# Altium schematic sheet 02-100BASETX_PHY.SchDoc
size A3; SheetNumber: 2; SheetTotal: 2
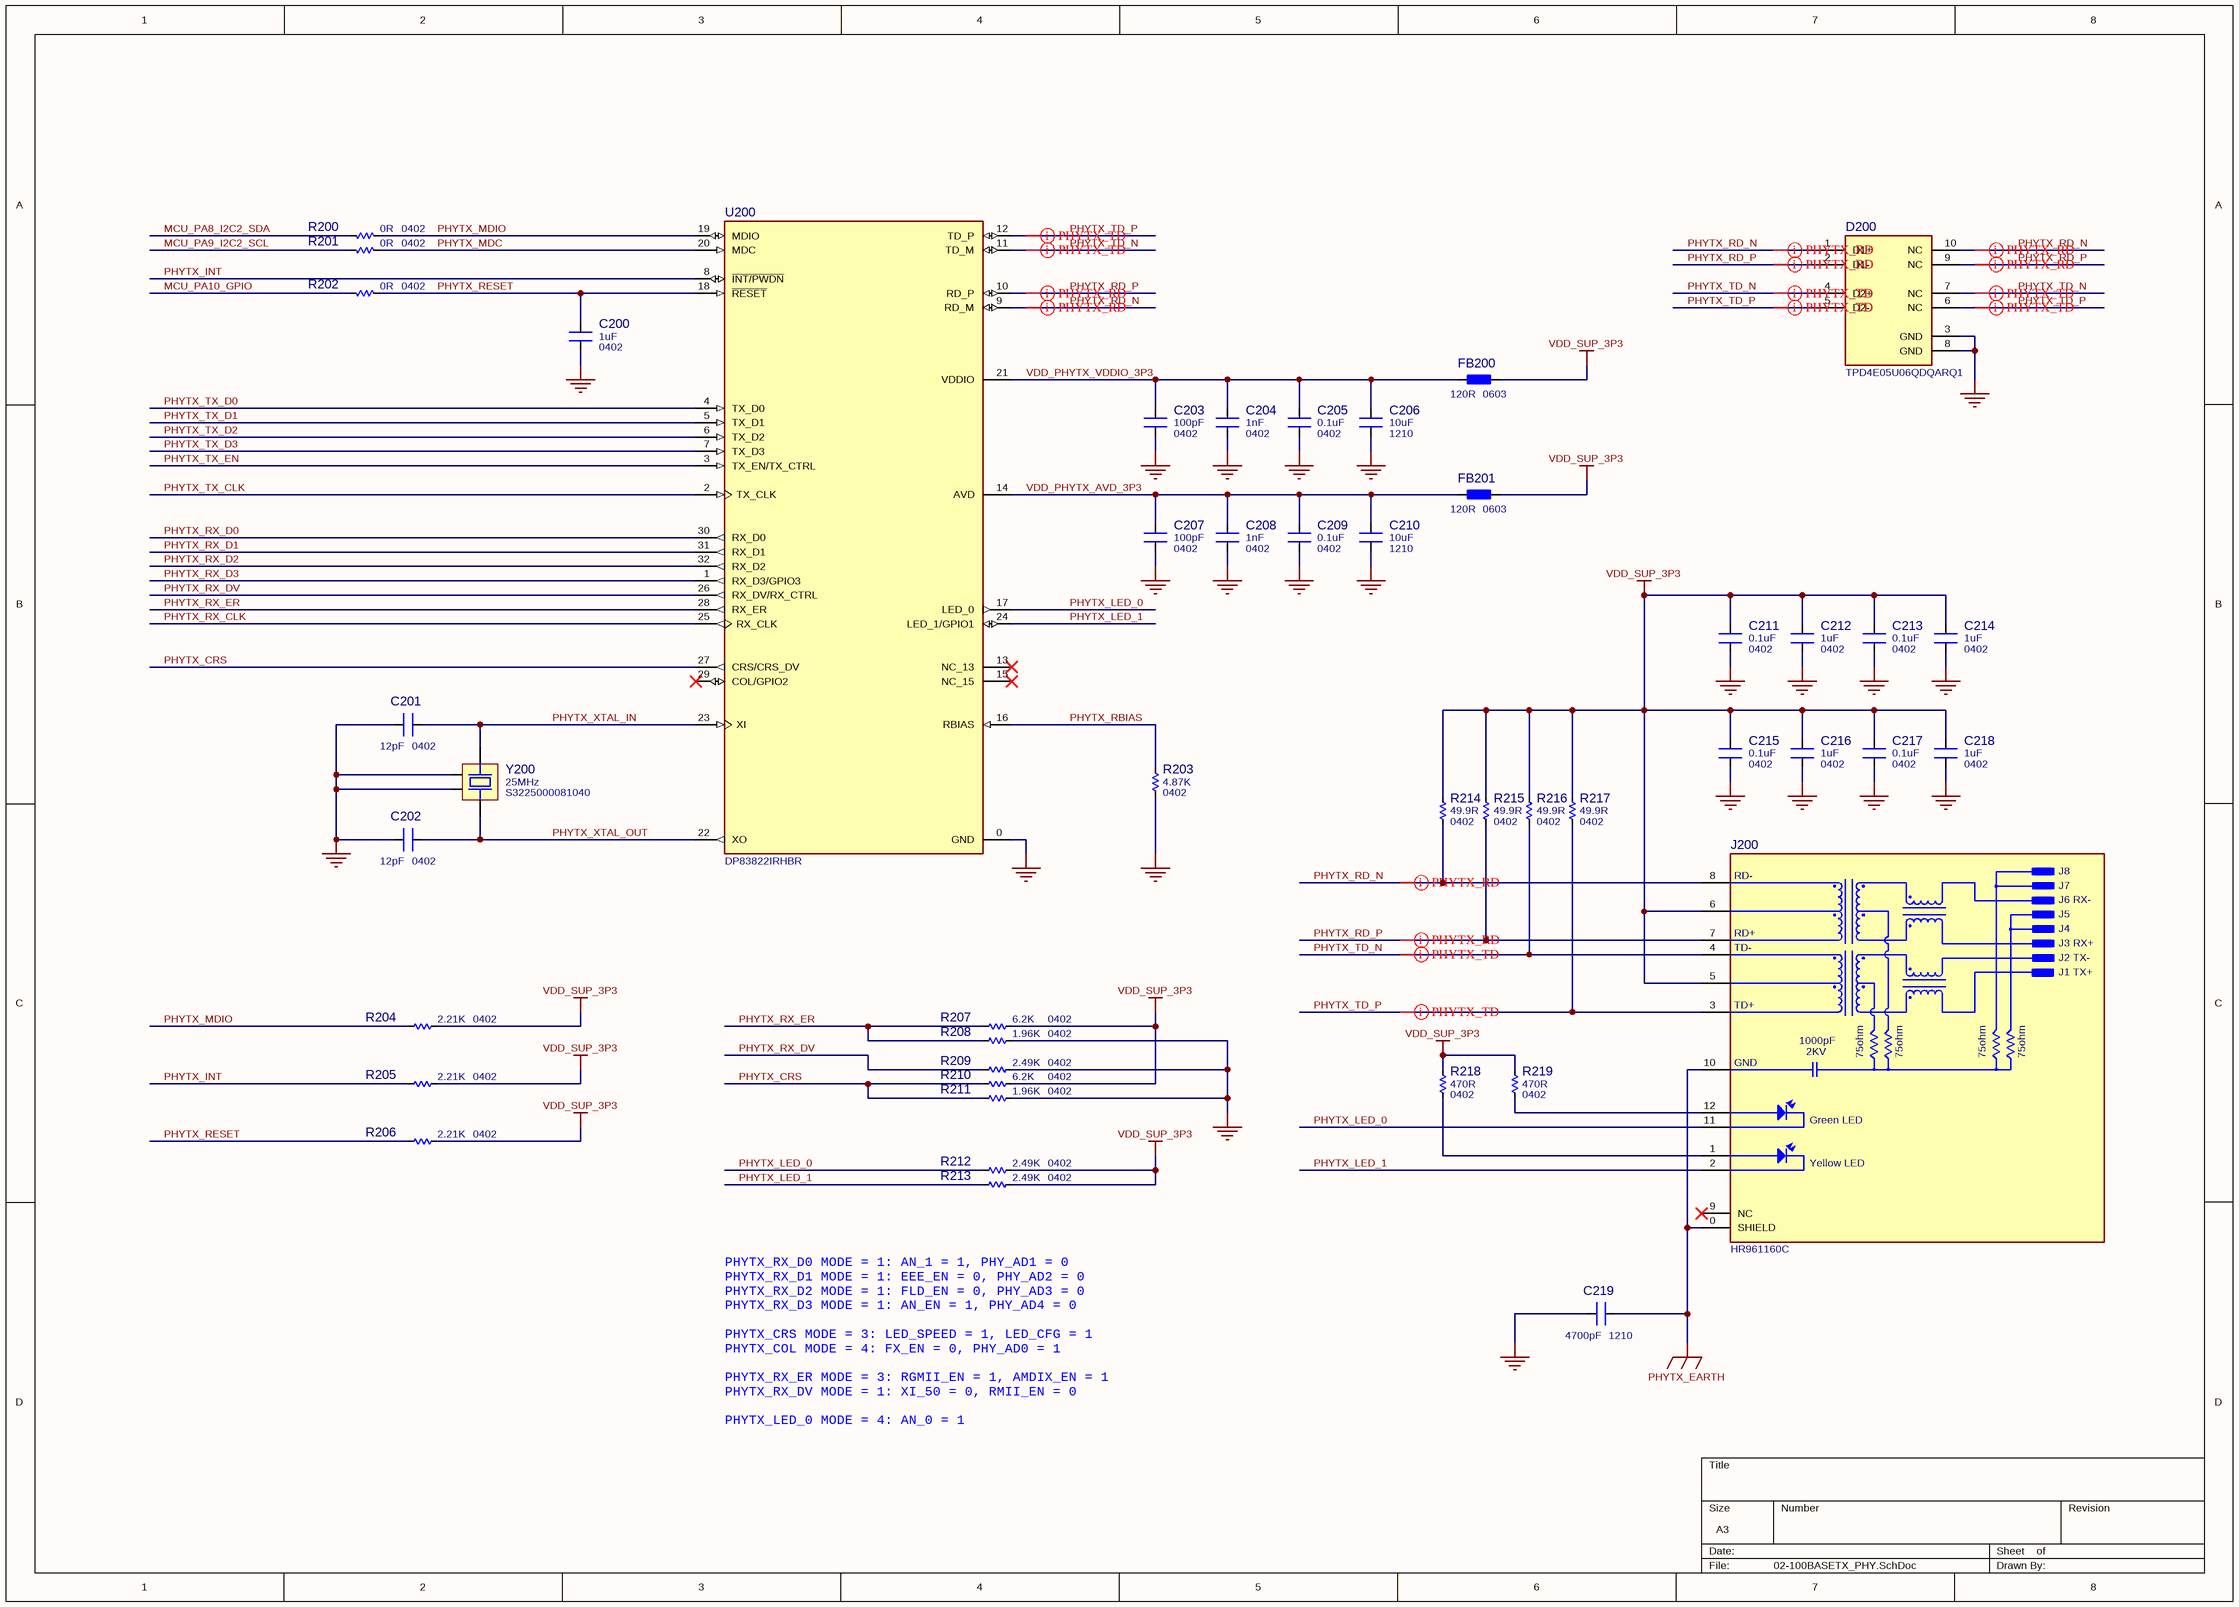
[diagram p0: 02-100BASETX_PHY.SchDoc]

## Parts
C200  value 1uF  Package: 0402  [CAP_C_0402]  (hidden comment: Capacitor NP)
C201  value 12pF  Package: 0402  [CAP_C_0402]  (hidden comment: Capacitor NP)
C202  value 12pF  Package: 0402  [CAP_C_0402]  (hidden comment: Capacitor NP)
C203  value 100pF  Package: 0402  [CAP_C_0402]  (hidden comment: Capacitor NP)
C204  value 1nF  Package: 0402  [CAP_C_0402]  (hidden comment: Capacitor NP)
C205  value 0.1uF  Package: 0402  [CAP_C_0402]  (hidden comment: Capacitor NP)
C206  value 10uF  Package: 1210  [CAP_C_1210]  (hidden comment: Capacitor NP)
C207  value 100pF  Package: 0402  [CAP_C_0402]  (hidden comment: Capacitor NP)
C208  value 1nF  Package: 0402  [CAP_C_0402]  (hidden comment: Capacitor NP)
C209  value 0.1uF  Package: 0402  [CAP_C_0402]  (hidden comment: Capacitor NP)
C210  value 10uF  Package: 1210  [CAP_C_1210]  (hidden comment: Capacitor NP)
C211  value 0.1uF  Package: 0402  [CAP_C_0402]  (hidden comment: Capacitor NP)
C212  value 1uF  Package: 0402  [CAP_C_0402]  (hidden comment: Capacitor NP)
C213  value 0.1uF  Package: 0402  [CAP_C_0402]  (hidden comment: Capacitor NP)
C214  value 1uF  Package: 0402  [CAP_C_0402]  (hidden comment: Capacitor NP)
C215  value 0.1uF  Package: 0402  [CAP_C_0402]  (hidden comment: Capacitor NP)
C216  value 1uF  Package: 0402  [CAP_C_0402]  (hidden comment: Capacitor NP)
C217  value 0.1uF  Package: 0402  [CAP_C_0402]  (hidden comment: Capacitor NP)
C218  value 1uF  Package: 0402  [CAP_C_0402]  (hidden comment: Capacitor NP)
C219  value 4700pF  Package: 1210  [CAP_C_1210]  (hidden comment: Capacitor NP)
D200  Manufacturer Part Number: TPD4E05U06QDQARQ1  [SON50P100X250X55-10N]  (hidden comment: TPDxE05U06-Q1)
FB200  value 120R  Package: 0603  [IND_C_0603]  (hidden comment: Ferrite bead)
FB201  value 120R  Package: 0603  [IND_C_0603]  (hidden comment: Ferrite bead)
J200  HR961160C  [RJ-45_HR961160C]
R200  value 0R  Package: 0402  [RES_C_0402]  (hidden comment: Resistor)
R201  value 0R  Package: 0402  [RES_C_0402]  (hidden comment: Resistor)
R202  value 0R  Package: 0402  [RES_C_0402]  (hidden comment: Resistor)
R203  value 4.87K  Package: 0402  [RES_C_0402]  (hidden comment: Resistor)
R204  value 2.21K  Package: 0402  [RES_C_0402]  (hidden comment: Resistor)
R205  value 2.21K  Package: 0402  [RES_C_0402]  (hidden comment: Resistor)
R206  value 2.21K  Package: 0402  [RES_C_0402]  (hidden comment: Resistor)
R207  value 6.2K  Package: 0402  [RES_C_0402]  (hidden comment: Resistor)
R208  value 1.96K  Package: 0402  [RES_C_0402]  (hidden comment: Resistor)
R209  value 2.49K  Package: 0402  [RES_C_0402]  (hidden comment: Resistor)
R210  value 6.2K  Package: 0402  [RES_C_0402]  (hidden comment: Resistor)
R211  value 1.96K  Package: 0402  [RES_C_0402]  (hidden comment: Resistor)
R212  value 2.49K  Package: 0402  [RES_C_0402]  (hidden comment: Resistor)
R213  value 2.49K  Package: 0402  [RES_C_0402]  (hidden comment: Resistor)
R214  value 49.9R  Package: 0402  [RES_C_0402]  (hidden comment: Resistor)
R215  value 49.9R  Package: 0402  [RES_C_0402]  (hidden comment: Resistor)
R216  value 49.9R  Package: 0402  [RES_C_0402]  (hidden comment: Resistor)
R217  value 49.9R  Package: 0402  [RES_C_0402]  (hidden comment: Resistor)
R218  value 470R  Package: 0402  [RES_C_0402]  (hidden comment: Resistor)
R219  value 470R  Package: 0402  [RES_C_0402]  (hidden comment: Resistor)
U200  Manufacturer Part Number: DP83822IRHBR  [QFN50P500X500X100_HS-33N]  (hidden comment: DP83822)
Y200  Manufacturer Part Number: S3225000081040  Frequency: 25MHz  [XT-SMD-3225-4P]  (hidden comment: Crystal)

## Nets
GND: C200.1 C201.2 C202.2 C203.1 C204.1 C205.1 C206.1 C207.1 C208.1 C209.1 C210.1 C211.1 C212.1 C213.1 C214.1 C215.1 C216.1 C217.1 C218.1 C219.2 D200.3(GND) D200.8(GND) R203.2 R208.2 R209.2 R211.2 U200.0(GND) Y200.2 Y200.4
PHYTX_EARTH: C219.1 J200.0(SHIELD) J200.10(GND)
VDD_SUP_3P3: C211.2 C212.2 C213.2 C214.2 C215.2 C216.2 C217.2 C218.2 FB200.1 FB201.1 J200.5(P5) J200.6(P6) R204.2 R205.2 R206.2 R207.2 R210.2 R212.2 R213.2 R214.1 R215.1 R216.1 R217.1 R218.1 R219.1
MCU_PA8_I2C2_SDA: R200.2
MCU_PA9_I2C2_SCL: R201.2
MCU_PA10_GPIO: R202.2
PHYTX_CRS: R210.1 R211.1 U200.27(CRS/CRS_DV)
PHYTX_INT: R205.1 U200.8(~{INT/PWDN})
PHYTX_LED_0: J200.11(GC) R212.1 U200.17(LED_0)
PHYTX_LED_1: J200.2(YC) R213.1 U200.24(LED_1/GPIO1)
PHYTX_MDC: R201.1 U200.20(MDC)
PHYTX_MDIO: R200.1 R204.1 U200.19(MDIO)
PHYTX_RBIAS: R203.1 U200.16(RBIAS)
PHYTX_RD_N: D200.1(D1+) D200.10(NC) J200.8(RD-) R214.2 U200.9(RD_M)
PHYTX_RD_P: D200.2(D1-) D200.9(NC) J200.7(RD+) R215.2 U200.10(RD_P)
PHYTX_RESET: C200.2 R202.1 R206.1 U200.18(~{RESET})
PHYTX_RX_CLK: U200.25(RX_CLK)
PHYTX_RX_D0: U200.30(RX_D0)
PHYTX_RX_D1: U200.31(RX_D1)
PHYTX_RX_D2: U200.32(RX_D2)
PHYTX_RX_D3: U200.1(RX_D3/GPIO3)
PHYTX_RX_DV: R209.1 U200.26(RX_DV/RX_CTRL)
PHYTX_RX_ER: R207.1 R208.1 U200.28(RX_ER)
PHYTX_TD_N: D200.4(D2+) D200.7(NC) J200.4(TD-) R216.2 U200.11(TD_M)
PHYTX_TD_P: D200.5(D2-) D200.6(NC) J200.3(TD+) R217.2 U200.12(TD_P)
PHYTX_TX_CLK: U200.2(TX_CLK)
PHYTX_TX_D0: U200.4(TX_D0)
PHYTX_TX_D1: U200.5(TX_D1)
PHYTX_TX_D2: U200.6(TX_D2)
PHYTX_TX_D3: U200.7(TX_D3)
PHYTX_TX_EN: U200.3(TX_EN/TX_CTRL)
PHYTX_XTAL_IN: C201.1 U200.23(XI) Y200.1
PHYTX_XTAL_OUT: C202.1 U200.22(XO) Y200.3
VDD_PHYTX_AVD_3P3: C207.2 C208.2 C209.2 C210.2 FB201.2 U200.14(AVD)
VDD_PHYTX_VDDIO_3P3: C203.2 C204.2 C205.2 C206.2 FB200.2 U200.21(VDDIO)
NetJ200_1: J200.1(YA) R218.2
NetJ200_12: J200.12(GA) R219.2

Not connected (* = marked no-connect by the designer): J200 9(NC)*; U200 13(NC_13)* 15(NC_15)* 29(COL/GPIO2)*

## Layout directives
differential pair; net class NC_DIFFPAIR_100R_ETH; differential pair class DIFFPAIR_100R_ETH: PHYTX_RD_N, PHYTX_RD_P, PHYTX_TD_N, PHYTX_TD_P

## Notes on the sheet
- PHYTX_RX_D0 MODE = 1: AN_1 = 1, PHY_AD1 = 0
- PHYTX_RX_D1 MODE = 1: EEE_EN = 0, PHY_AD2 = 0
- PHYTX_RX_D2 MODE = 1: FLD_EN = 0, PHY_AD3 = 0
- PHYTX_RX_D3 MODE = 1: AN_EN = 1, PHY_AD4 = 0
- PHYTX_CRS MODE = 3: LED_SPEED = 1, LED_CFG = 1
- PHYTX_COL MODE = 4: FX_EN = 0, PHY_AD0 = 1
- PHYTX_RX_ER MODE = 3: RGMII_EN = 1, AMDIX_EN = 1
- PHYTX_RX_DV MODE = 1: XI_50 = 0, RMII_EN = 0
- PHYTX_LED_0 MODE = 4: AN_0 = 1
- (in symbol HR961160C) J8; J7; J6 RX-; J5; J4; J3 RX+; J2 TX-; J1 TX+; 1000pF; 2KV; 75ohm; Green LED; Yellow LED

## Library data of the parts
C200 C212 C214 C216 C218 = Cap: Ceramic Capacitor SMD 0402 1uF ±10% 25V; Manufacturer: Samsung; Manufacturer Part Number: CL05A105KA5NQNC; Temperature Coeffcient: -55 to 85℃; Revision: 0; Tolerance: ±10%; ComponentLink1URL: http://product.samsungsem.com/mlcc/CL05A105KA5NQN.do; ComponentLink1Description: SVN Datasheet; ComponentLink2URL: *; ComponentLink2Description: Local Datasheet; ComponentLink3URL: D:\Altium\Library\AS50 library\AS50.SchLib; ComponentLink3Description: Open Symbol; ComponentLink4URL: D:\Altium\Library\AS50 library\Capacitors.PcbLib; ComponentLink4Description: Open Footprint; ComponentLink5Description: Open Footprint 2; ComponentLink6Description: Open Footprint 3; ComponentLink7Description: Open Footprint 4; Category: Capacitor; Voltage: 25V; Supplier 1: LCSC; Supplier Part Number 1: C52923
C201 C202 = Cap: Ceramic Capacitor SMD 0402 12pF ±5% 50V; Manufacturer: FH(Guangdong Fenghua Advanced Tech); Manufacturer Part Number: 0402CG120J500NT; Temperature Coeffcient: -55 to 85℃; Revision: 0; Tolerance: ±5%; ComponentLink1URL: https://datasheet.lcsc.com/lcsc/1810111610_FH-Guangdong-Fenghua-Advanced-Tech-0402CG150J500NT_C1548.pdf; ComponentLink1Description: SVN Datasheet; ComponentLink2URL: *; ComponentLink2Description: Local Datasheet; ComponentLink3URL: D:\Altium\Library\AS50 library\AS50.SchLib; ComponentLink3Description: Open Symbol; ComponentLink4URL: D:\Altium\Library\AS50 library\Capacitors.PcbLib; ComponentLink4Description: Open Footprint; ComponentLink5Description: Open Footprint 2; ComponentLink6Description: Open Footprint 3; ComponentLink7Description: Open Footprint 4; Category: Capacitor; Voltage: 50V; Supplier 1: LCSC; Supplier Part Number 1: C1547
C203 C207 = Cap: Ceramic Capacitor SMD 0402 100pF ±5% 50V; Manufacturer: Samsung; Manufacturer Part Number: CL05C101JB5NNNC; Temperature Coeffcient: -55 to 85℃; Revision: 0; Tolerance: ±5%; ComponentLink1URL: http://product.samsungsem.com/mlcc/CL05B224KO5NNN.do; ComponentLink1Description: SVN Datasheet; ComponentLink2URL: *; ComponentLink2Description: Local Datasheet; ComponentLink3URL: D:\Altium\Library\AS50 library\AS50.SchLib; ComponentLink3Description: Open Symbol; ComponentLink4URL: D:\Altium\Library\AS50 library\Capacitors.PcbLib; ComponentLink4Description: Open Footprint; ComponentLink5Description: Open Footprint 2; ComponentLink6Description: Open Footprint 3; ComponentLink7Description: Open Footprint 4; Category: Capacitor; Voltage: 50V; Supplier 1: LCSC; Supplier Part Number 1: C26409
C204 C208 = Cap: Ceramic Capacitor SMD 0402 1nF ±10% 50V; Manufacturer: Samsung; Manufacturer Part Number: CL05B102KB5NNNC; Temperature Coeffcient: -55 to 85℃; Revision: 0; Tolerance: ±10%; ComponentLink1URL: http://product.samsungsem.com/mlcc/CL05B224KO5NNN.do; ComponentLink1Description: SVN Datasheet; ComponentLink2URL: *; ComponentLink2Description: Local Datasheet; ComponentLink3URL: D:\Altium\Library\AS50 library\AS50.SchLib; ComponentLink3Description: Open Symbol; ComponentLink4URL: D:\Altium\Library\AS50 library\Capacitors.PcbLib; ComponentLink4Description: Open Footprint; ComponentLink5Description: Open Footprint 2; ComponentLink6Description: Open Footprint 3; ComponentLink7Description: Open Footprint 4; Category: Capacitor; Voltage: 50V; Supplier 1: LCSC; Supplier Part Number 1: C14442
C205 C209 C211 C213 C215 C217 = Cap: Ceramic Capacitor SMD 0402 100nF ±10% 16V; Manufacturer: Samsung; Manufacturer Part Number: CL05B104KO5NNNC; Temperature Coeffcient: -55 to 85℃; Revision: 0; Tolerance: ±10%; ComponentLink1URL: http://product.samsungsem.com/mlcc/CL05B104KO5NNN.do; ComponentLink1Description: SVN Datasheet; ComponentLink2URL: *; ComponentLink2Description: Local Datasheet; ComponentLink3URL: D:\Altium\Library\AS50 library\AS50.SchLib; ComponentLink3Description: Open Symbol; ComponentLink4URL: D:\Altium\Library\AS50 library\Capacitors.PcbLib; ComponentLink4Description: Open Footprint; ComponentLink5Description: Open Footprint 2; ComponentLink6Description: Open Footprint 3; ComponentLink7Description: Open Footprint 4; Category: Capacitor; Voltage: 16V; Supplier 1: LCSC; Supplier Part Number 1: C1525
C206 C210 = Cap: Ceramic Capacitor SMD 1210 10uF ±10% 25V; Manufacturer: Samsung; Manufacturer Part Number: CL32B106KAJNNNE; Temperature Coeffcient: -55 to 85℃; Revision: 0; Tolerance: ±10%; ComponentLink1URL: http://product.samsungsem.com/mlcc/CL05A105KA5NQN.do; ComponentLink1Description: SVN Datasheet; ComponentLink2URL: *; ComponentLink2Description: Local Datasheet; ComponentLink3URL: D:\Altium\Library\AS50 library\AS50.SchLib; ComponentLink3Description: Open Symbol; ComponentLink4URL: D:\Altium\Library\AS50 library\Capacitors.PcbLib; ComponentLink4Description: Open Footprint; ComponentLink5Description: Open Footprint 2; ComponentLink6Description: Open Footprint 3; ComponentLink7Description: Open Footprint 4; Category: Capacitor; Voltage: 25V; Supplier 1: LCSC; Supplier Part Number 1: C39232
C219 = Cap: Ceramic Capacitor SMD 1210 4700pF ±10% 2kV; Manufacturer: KEMET; Manufacturer Part Number: C1210C472KGRAC7800; Temperature Coeffcient: -55 to 85℃; Revision: 0; Tolerance: ±10%; ComponentLink1URL: https://datasheet.lcsc.com/lcsc/1810111610_FH-Guangdong-Fenghua-Advanced-Tech-0402CG150J500NT_C1548.pdf; ComponentLink1Description: SVN Datasheet; ComponentLink2URL: *; ComponentLink2Description: Local Datasheet; ComponentLink3URL: D:\Altium\Library\AS50 library\AS50.SchLib; ComponentLink3Description: Open Symbol; ComponentLink4URL: D:\Altium\Library\AS50 library\Capacitors.PcbLib; ComponentLink4Description: Open Footprint; ComponentLink5Description: Open Footprint 2; ComponentLink6Description: Open Footprint 3; ComponentLink7Description: Open Footprint 4; Category: Capacitor; Voltage: 2kV; Supplier 1: Digikey; Supplier Part Number 1: 399-C1210C472KGRAC7800CT-ND
D200 = TPDxE05U06-Q1: Texas Instruments 1 and 4 Channel ESD Protection Diodes for SuperSpeed (Up to 6 Gbps) Interface; Category: Diodes; Manufacturer: Texas Instruments; Supplier 1: LCSC; Supplier Part Number 1: C81353; ComponentLink1Description: SVD Datasheet; ComponentLink1URL: https://www.ti.com/lit/ds/symlink/tpd4e05u06-q1.pdf; ComponentLink2Description: Local Datasheet; ComponentLink2URL: *; ComponentLink3Description: Open Symbol; ComponentLink3URL: D:\Altium\Library\AS50 library\AS50.SchLib; ComponentLink4Description: Open Footprint; ComponentLink4URL: D:\Altium\Library\AS50 library\Diodes.PcbLib
FB200 FB201 = Ferrite bead: Ferrite bead SMD 0603 120Ω ±25% @ 100MHz DCR=0.03Ω 3A; Manufacturer: Murata Electronics; Manufacturer Part Number: BLM18KG121TH1D; Category: Ferrite Bead; Tolerance: 25%; Frequency: 100MHz; DC Current: 3A; ComponentLink1URL: https://www.sunlordinc.com/Download.aspx?file=L1VwbG9hZEZpbGVzL1BERl9DYXQvMjAyMTA5MDcxNDU1NTM2OC5wZGY=&lan=en; ComponentLink1Description: SVN Datasheet; ComponentLink2URL: *; ComponentLink2Description: Local Datasheet; ComponentLink3URL: D:\Altium\Library\AS50 library\AS50.SchLib; ComponentLink3Description: Open Symbol; ComponentLink4URL: D:\Altium\Library\AS50 library\Inductors.PcbLib; ComponentLink4Description: Open Footprint; Supplier 1: LCSC; Supplier Part Number 1: C437404
J200 = HR961160C: Single port RJ45 Connector with Integrated Magnetics and LED for 10/100-BaseTX NIC Applications; Manufacturer: HanRun; Manufacturer Part Number: HR961160C; Supplier 1: LCSC; Supplier Part Number 1: C55683; Category: Connectors; ComponentLink1Description: SVD Datasheeet; ComponentLink1URL: https://datasheet.lcsc.com/lcsc/1811141110_HANRUN-Zhongshan-HanRun-Elec-HR961160C_C55683.pdf; ComponentLink2Description: Local Datasheet; ComponentLink2URL: *; ComponentLink3Description: Open Symbol; ComponentLink3URL: D:\Altium\Library\AS50 library\AS50.SchLib; ComponentLink4Description: Open Footprint; ComponentLink4URL: D:\Altium\Library\AS50 library\Connectors.PcbLib
R200-R202 = Res: Resistor SMD 0402 0R ±1% 1/16W; Manufacturer: UNI-ROYAL(Uniroyal Elec); Manufacturer Part Number: 0402WGF0000TCE; Voltage: 50V; Temperature Coeffcient: ±100ppm/C; Tolerance: ±1%; Revision: 0; ComponentLink1URL: http://uni-royal.cn/images/userfile/file/1590821906c56505e6d9ab55c7.pdf; ComponentLink1Description: SVN Datasheet; ComponentLink2URL: *; ComponentLink2Description: Local Datasheet; ComponentLink3URL: D:\Altium\Library\AS50 library\AS50.SchLib; ComponentLink3Description: Open Symbol; ComponentLink4URL: D:\Altium\Library\AS50 library\Resistors.PcbLib; ComponentLink4Description: Open Footprint; ComponentLink5Description: Open Footprint 2; ComponentLink6Description: Open Footprint 3; ComponentLink7Description: Open Footprint 4; Operating Temperature: -55C to +155C; Category: Resistor; Power: 1/16W; Supplier 1: LCSC; Supplier Part Number 1: C17168
R203 = Res: Resistor SMD 0402 4.87K ±1% 1/16W; Manufacturer: UNI-ROYAL(Uniroyal Elec); Manufacturer Part Number: 0402WGF4871TCE; Voltage: 50V; Temperature Coeffcient: ±100ppm/C; Tolerance: ±1%; Revision: 0; ComponentLink1URL: http://uni-royal.cn/images/userfile/file/1590821906c56505e6d9ab55c7.pdf; ComponentLink1Description: SVN Datasheet; ComponentLink2URL: *; ComponentLink2Description: Local Datasheet; ComponentLink3URL: D:\Altium\Library\AS50 library\AS50.SchLib; ComponentLink3Description: Open Symbol; ComponentLink4URL: D:\Altium\Library\AS50 library\Resistors.PcbLib; ComponentLink4Description: Open Footprint; ComponentLink5Description: Open Footprint 2; ComponentLink6Description: Open Footprint 3; ComponentLink7Description: Open Footprint 4; Operating Temperature: -55C to +155C; Category: Resistor; Power: 1/16W; Supplier 1: LCSC; Supplier Part Number 1: C25902
R204-R206 = Res: Resistor SMD 0402 2.21K ±1% 1/16W; Manufacturer: UNI-ROYAL(Uniroyal Elec); Manufacturer Part Number: 0402WGF2211TCE; Voltage: 50V; Temperature Coeffcient: ±100ppm/C; Tolerance: ±1%; Revision: 0; ComponentLink1URL: http://uni-royal.cn/images/userfile/file/1590821906c56505e6d9ab55c7.pdf; ComponentLink1Description: SVN Datasheet; ComponentLink2URL: *; ComponentLink2Description: Local Datasheet; ComponentLink3URL: D:\Altium\Library\AS50 library\AS50.SchLib; ComponentLink3Description: Open Symbol; ComponentLink4URL: D:\Altium\Library\AS50 library\Resistors.PcbLib; ComponentLink4Description: Open Footprint; ComponentLink5Description: Open Footprint 2; ComponentLink6Description: Open Footprint 3; ComponentLink7Description: Open Footprint 4; Operating Temperature: -55C to +155C; Category: Resistor; Power: 1/16W; Supplier 1: LCSC; Supplier Part Number 1: C25880
R207 R210 = Res: Resistor SMD 0402 6.2K ±1% 1/16W; Manufacturer: UNI-ROYAL(Uniroyal Elec); Manufacturer Part Number: 0402WGF6201TCE; Voltage: 50V; Temperature Coeffcient: ±100ppm/C; Tolerance: ±1%; Revision: 0; ComponentLink1URL: http://uni-royal.cn/images/userfile/file/1590821906c56505e6d9ab55c7.pdf; ComponentLink1Description: SVN Datasheet; ComponentLink2URL: *; ComponentLink2Description: Local Datasheet; ComponentLink3URL: D:\Altium\Library\AS50 library\AS50.SchLib; ComponentLink3Description: Open Symbol; ComponentLink4URL: D:\Altium\Library\AS50 library\Resistors.PcbLib; ComponentLink4Description: Open Footprint; ComponentLink5Description: Open Footprint 2; ComponentLink6Description: Open Footprint 3; ComponentLink7Description: Open Footprint 4; Operating Temperature: -55C to +155C; Category: Resistor; Power: 1/16W; Supplier 1: LCSC; Supplier Part Number 1: C25915
R208 R211 = Res: Resistor SMD 0402 1.96K ±1% 1/16W; Manufacturer: UNI-ROYAL(Uniroyal Elec); Manufacturer Part Number: 0402WGF1961TCE; Voltage: 50V; Temperature Coeffcient: ±100ppm/C; Tolerance: ±1%; Revision: 0; ComponentLink1URL: http://uni-royal.cn/images/userfile/file/1590821906c56505e6d9ab55c7.pdf; ComponentLink1Description: SVN Datasheet; ComponentLink2URL: *; ComponentLink2Description: Local Datasheet; ComponentLink3URL: D:\Altium\Library\AS50 library\AS50.SchLib; ComponentLink3Description: Open Symbol; ComponentLink4URL: D:\Altium\Library\AS50 library\Resistors.PcbLib; ComponentLink4Description: Open Footprint; ComponentLink5Description: Open Footprint 2; ComponentLink6Description: Open Footprint 3; ComponentLink7Description: Open Footprint 4; Operating Temperature: -55C to +155C; Category: Resistor; Power: 1/16W; Supplier 1: LCSC; Supplier Part Number 1: C70427
R209 R212 R213 = Res: Resistor SMD 0402 2.49K ±1% 1/16W; Manufacturer: UNI-ROYAL(Uniroyal Elec); Manufacturer Part Number: 0402WGF2491TCE; Voltage: 50V; Temperature Coeffcient: ±100ppm/C; Tolerance: ±1%; Revision: 0; ComponentLink1URL: http://uni-royal.cn/images/userfile/file/1590821906c56505e6d9ab55c7.pdf; ComponentLink1Description: SVN Datasheet; ComponentLink2URL: *; ComponentLink2Description: Local Datasheet; ComponentLink3URL: D:\Altium\Library\AS50 library\AS50.SchLib; ComponentLink3Description: Open Symbol; ComponentLink4URL: D:\Altium\Library\AS50 library\Resistors.PcbLib; ComponentLink4Description: Open Footprint; ComponentLink5Description: Open Footprint 2; ComponentLink6Description: Open Footprint 3; ComponentLink7Description: Open Footprint 4; Operating Temperature: -55C to +155C; Category: Resistor; Power: 1/16W; Supplier 1: LCSC; Supplier Part Number 1: C25884
R214-R217 = Res: Resistor SMD 0402 49.9R ±1% 1/16W; Manufacturer: UNI-ROYAL(Uniroyal Elec); Manufacturer Part Number: 0402WGF499JTCE; Voltage: 50V; Temperature Coeffcient: ±100ppm/C; Tolerance: ±1%; Revision: 0; ComponentLink1URL: http://uni-royal.cn/images/userfile/file/1590821906c56505e6d9ab55c7.pdf; ComponentLink1Description: SVN Datasheet; ComponentLink2URL: *; ComponentLink2Description: Local Datasheet; ComponentLink3URL: D:\Altium\Library\AS50 library\AS50.SchLib; ComponentLink3Description: Open Symbol; ComponentLink4URL: D:\Altium\Library\AS50 library\Resistors.PcbLib; ComponentLink4Description: Open Footprint; ComponentLink5Description: Open Footprint 2; ComponentLink6Description: Open Footprint 3; ComponentLink7Description: Open Footprint 4; Operating Temperature: -55C to +155C; Category: Resistor; Power: 1/16W; Supplier 1: LCSC; Supplier Part Number 1: C25120
R218 R219 = Res: Resistor SMD 0402 470R ±1% 1/16W; Manufacturer: UNI-ROYAL(Uniroyal Elec); Manufacturer Part Number: 0402WGF4700TCE; Voltage: 50V; Temperature Coeffcient: ±100ppm/C; Tolerance: ±1%; Revision: 0; ComponentLink1URL: http://uni-royal.cn/images/userfile/file/1590821906c56505e6d9ab55c7.pdf; ComponentLink1Description: SVN Datasheet; ComponentLink2URL: *; ComponentLink2Description: Local Datasheet; ComponentLink3URL: D:\Altium\Library\AS50 library\AS50.SchLib; ComponentLink3Description: Open Symbol; ComponentLink4URL: D:\Altium\Library\AS50 library\Resistors.PcbLib; ComponentLink4Description: Open Footprint; ComponentLink5Description: Open Footprint 2; ComponentLink6Description: Open Footprint 3; ComponentLink7Description: Open Footprint 4; Operating Temperature: -55C to +155C; Category: Resistor; Power: 1/16W; Supplier 1: LCSC; Supplier Part Number 1: C25117
U200 = DP83822: Texas Instruments Low Power 10/100 Mbps Ethernet Physical Layer Transceiver; Category: ICs; Manufacturer: Texas Instruments; Supplier 1: Digikey; Supplier Part Number 1: 296-47256-1-ND; ComponentLink1Description: SVD Datasheet; ComponentLink1URL: https://www.ti.com/lit/ds/symlink/dp83822i.pdf; ComponentLink2Description: Local Datasheet; ComponentLink2URL: *; ComponentLink3Description: Open Symbol; ComponentLink3URL: D:\Altium\Library\AS50 library\AS50.SchLib; ComponentLink4Description: Open Footprint; ComponentLink4URL: D:\Altium\Library\AS50 library\IC.PcbLib
Y200 = CX3225SB12000H0PSTC1: 25MHz SMD Crystal Resonator 8pF 40Ω ±10ppm -40℃~+85℃ SMD3225-4P; Manufacturer: JGHC; Supplier 1: LCSC; Category: Crystals; ComponentLink1URL: https://www.yxcxtal.com/u_file/photo/20200311/YSX321SL-Datasheet.pdf; ComponentLink1Description: SVD Datasheet; ComponentLink2URL: *; ComponentLink2Description: Local Datasheet; Supplier Part Number 1: C479202; ComponentLink3Description: Open Symbol; ComponentLink3URL: D:\Altium\Library\AS50 library\AS50.SchLib; ComponentLink4Description: Open Footprint; ComponentLink4URL: D:\Altium\Library\AS50 library\Crystals.PcbLib